# Altium schematic sheet power_connector.SchDoc
size A4
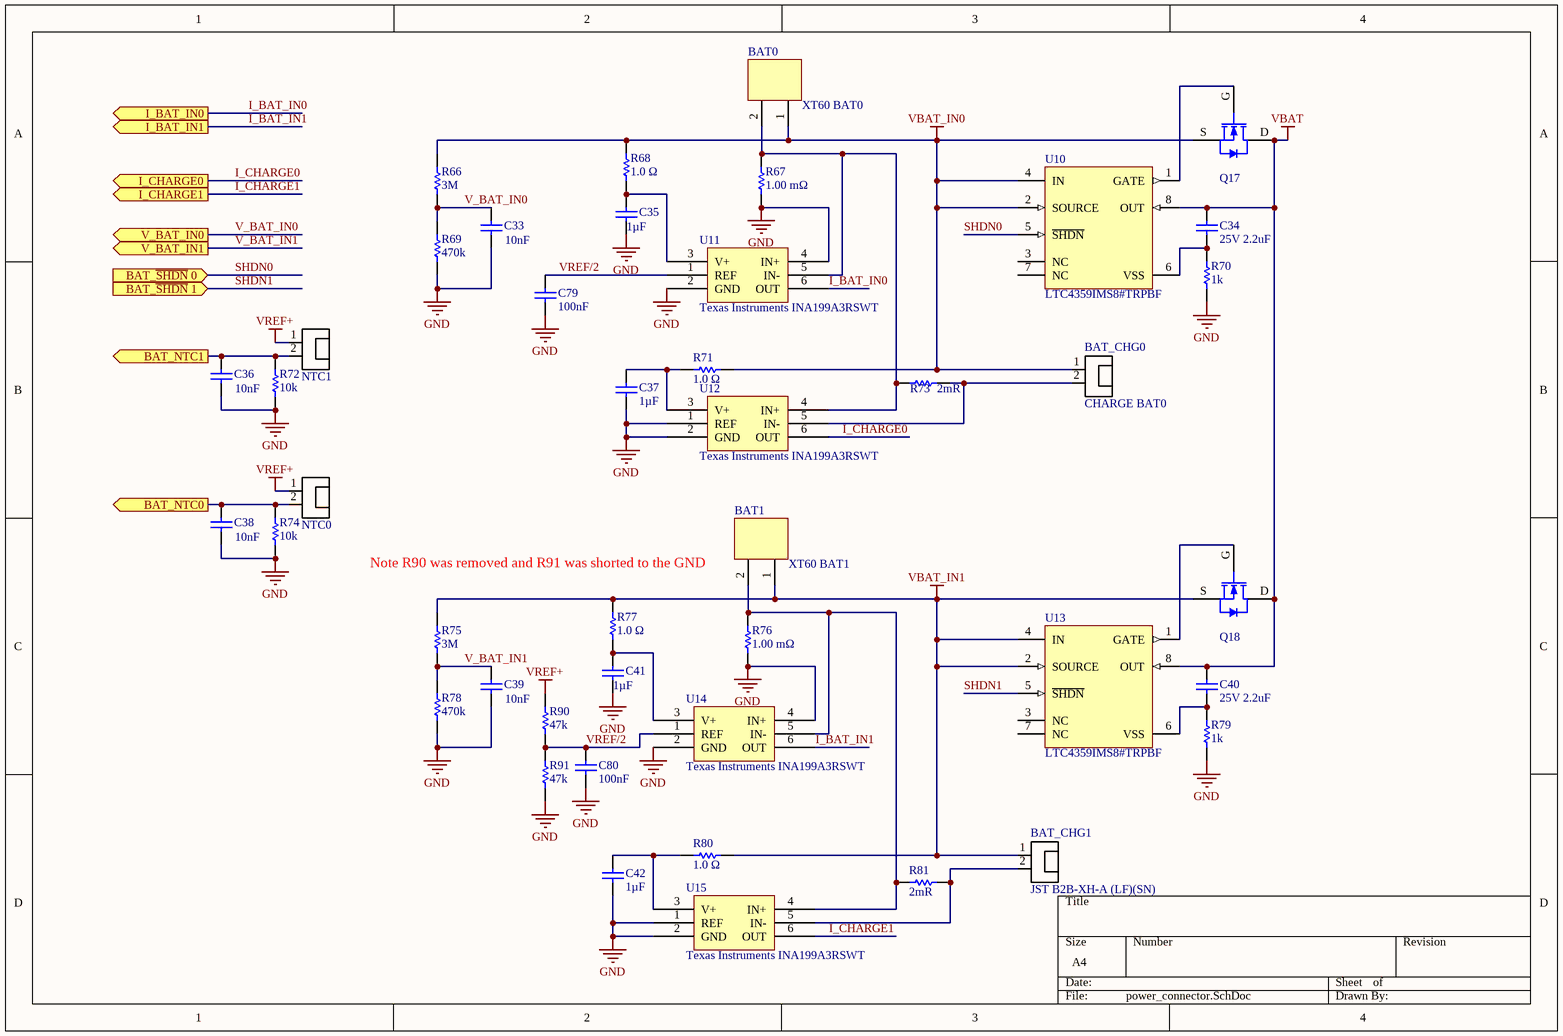
[diagram p0: power_connector.SchDoc]

## Parts
BAT0  XT60 BAT0  [PCB-8tmbcd94dx0l5ponnqur-1]
BAT1  XT60 BAT1  [PCB-8tmbcd94dx0l5ponnqur-1]
BAT_CHG0  CHARGE BAT0  [PCB-s8s8ac3ylnu6waak0fxh-1]
BAT_CHG1  JST B2B-XH-A (LF)(SN)  [PCB-s8s8ac3ylnu6waak0fxh-1]
C33  10nF  [RESC1005X40X25LL05T05]
C34  25V 2.2uF  [C0805]
C35  1µF  [CAPC1608X90X35LL15T15]
C36  10nF  [RESC1005X40X25LL05T05]
C37  1µF  [CAPC1608X90X35LL15T15]
C38  10nF  [RESC1005X40X25LL05T05]
C39  10nF  [RESC1005X40X25LL05T05]
C40  25V 2.2uF  [C0805]
C41  1µF  [CAPC1608X90X35LL15T15]
C42  1µF  [CAPC1608X90X35LL15T15]
C79  100nF  [CAPC1005X56X25NL10T15]
C80  100nF  [CAPC1005X56X25NL10T15]
NTC0  JST B2B-XH-A (LF)(SN)  [PCB-s8s8ac3ylnu6waak0fxh-1]  (value not drawn)
NTC1  JST B2B-XH-A (LF)(SN)  [PCB-s8s8ac3ylnu6waak0fxh-1]  (value not drawn)
Q17  SYM-77c1bbb3bdeca806-1  [PCB-0cgmvcmmtwpbvwdhxnni-1]  (value not drawn)
Q18  SYM-77c1bbb3bdeca806-1  [PCB-0cgmvcmmtwpbvwdhxnni-1]  (value not drawn)
R66  3M  [RESC1608X55X30LL15T15]
R67  1.00 mΩ  [PCB-wws5gc0zzodyoofoa1sn-1]
R68  1.0 Ω  [RESC1609X50X30LL10T20]
R69  470k  [RESC1609X55X30LL10T20]
R70  1k  [RESC1608X55X30NL15T15]
R71  1.0 Ω  [RESC1609X50X30LL10T20]
R72  10k  [RESC1608X55X30NL15T15]
R73  2mR  [RESC3216X89X51ML25T25]
R74  10k  [RESC1608X55X30NL15T15]
R75  3M  [RESC1608X55X30LL15T15]
R76  1.00 mΩ  [PCB-wws5gc0zzodyoofoa1sn-1]
R77  1.0 Ω  [RESC1609X50X30LL10T20]
R78  470k  [RESC1609X55X30LL10T20]
R79  1k  [RESC1608X55X30NL15T15]
R80  1.0 Ω  [RESC1609X50X30LL10T20]
R81  2mR  [RESC3216X89X51ML25T25]
R90  47k  [RESC1005X40X25LL05T10]
R91  47k  [RESC1005X40X25LL05T10]
U10  LTC4359IMS8#TRPBF  [LT-MS8-8_L]
U11  Texas Instruments INA199A3RSWT  [PCB-dzg43p1s5wcf61j10amz-1]
U12  Texas Instruments INA199A3RSWT  [PCB-dzg43p1s5wcf61j10amz-1]
U13  LTC4359IMS8#TRPBF  [LT-MS8-8_L]
U14  Texas Instruments INA199A3RSWT  [PCB-dzg43p1s5wcf61j10amz-1]
U15  Texas Instruments INA199A3RSWT  [PCB-dzg43p1s5wcf61j10amz-1]

## Ports
BAT_NTC0 (out), BAT_NTC1 (out), BAT_~{SHDN} 0 (in), BAT_~{SHDN} 1 (in), I_BAT_IN0 (out), I_BAT_IN1 (out), I_CHARGE0 (out), I_CHARGE1 (out), V_BAT_IN0 (out), V_BAT_IN1 (out)

## Nets
GND: C33.1 C35.2 C36.1 C37.2 C38.1 C39.1 C41.2 C42.2 C79.2 C80.2 R67.1 R69.1 R70.1 R72.1 R74.2 R76.1 R78.1 R79.1 R91.1 U11.2(GND) U11.4(IN+) U12.1(REF) U12.2(GND) U14.2(GND) U14.4(IN+) U15.1(REF) U15.2(GND)
VBAT: C34.1 C40.1 Q17.D Q18.D U10.8(OUT) U13.8(OUT)
VBAT_IN0: BAT0.1 BAT_CHG0.1 Q17.S R66.2 R68.2 R71.2 U10.2(SOURCE) U10.4(IN)
VBAT_IN1: BAT1.1 BAT_CHG1.1 Q18.S R75.2 R77.2 R80.2 U13.2(SOURCE) U13.4(IN)
VREF+: NTC0.1 NTC1.1 R90.2
BAT_NTC0: C38.2 NTC0.2 R74.1 ; port BAT_NTC0
BAT_NTC1: C36.2 NTC1.2 R72.2 ; port BAT_NTC1
I_BAT_IN0: U11.6(OUT) ; port I_BAT_IN0
I_BAT_IN1: U14.6(OUT) ; port I_BAT_IN1
I_CHARGE0: U12.6(OUT) ; port I_CHARGE0
I_CHARGE1: U15.6(OUT) ; port I_CHARGE1
SHDN0: U10.5(~{SHDN}) ; port BAT_~{SHDN} 0
SHDN1: U13.5(~{SHDN}) ; port BAT_~{SHDN} 1
V_BAT_IN0: C33.2 R66.1 R69.2 ; port V_BAT_IN0
V_BAT_IN1: C39.2 R75.1 R78.2 ; port V_BAT_IN1
VREF/2: C79.1 C80.1 R90.1 R91.2 U11.1(REF) U14.1(REF)
NetBAT0_2: BAT0.2 R67.2 R73.2 U11.5(IN-) U12.4(IN+)
NetBAT1_2: BAT1.2 R76.2 R81.1 U14.5(IN-) U15.4(IN+)
NetBAT_CHG0_2: BAT_CHG0.2 R73.1 U12.5(IN-)
NetBAT_CHG1_2: BAT_CHG1.2 R81.2 U15.5(IN-)
NetC34_2: C34.2 R70.2 U10.6(VSS)
NetC35_1: C35.1 R68.1 U11.3(V+)
NetC37_1: C37.1 R71.1 U12.3(V+)
NetC40_2: C40.2 R79.2 U13.6(VSS)
NetC41_1: C41.1 R77.1 U14.3(V+)
NetC42_1: C42.1 R80.1 U15.3(V+)
NetQ17_G: Q17.G U10.1(GATE)
NetQ18_G: Q18.G U13.1(GATE)

Not connected (* = marked no-connect by the designer): U10 3(NC) 7(NC); U13 3(NC) 7(NC)

## Notes on the sheet
- (near BAT1) Note R90 was removed and R91 was shorted to the GND

## Library data of the parts
BAT0 BAT1 = CMP-d8151592827e07d2-9: XT60 Connector Male
BAT_CHG0 = CMP-a2a66bdac84f7d61-16: XH Series 2 Position 2.5 mm Pitch Through Hole Top Entry Shrouded Header; Manufacturer Part Number: B2B-XH-A (LF)(SN); Gender: Male; Voltage Rating (AC): 250 V; Lead-Free Status: Lead Free; Insulation Resistance: 1.00 GΩ; Number of Contacts: 2; Contact Resistance: 10.0 mΩ; Current Rating: 3.00 A; Mounting Style: Through Hole, Vertical; RoHS: Compliant; Octopart URL: http://octopart.com/b2b-xh-a+%28lf%29%28sn%29-jst-7753615; Contact Material: Brass; REACH SVHC Compliance: No SVHC; OctopartID: a2a66bdac84f7d61; Contact Plating: Tin
BAT_CHG1 NTC0 NTC1 = CMP-a2a66bdac84f7d61-16: XH Series 2 Position 2.5 mm Pitch Through Hole Top Entry Shrouded Header; Gender: Male; Voltage Rating (AC): 250 V; Lead-Free Status: Lead Free; Insulation Resistance: 1.00 GΩ; Number of Contacts: 2; Contact Resistance: 10.0 mΩ; Current Rating: 3.00 A; Mounting Style: Through Hole, Vertical; RoHS: Compliant; Manufacturer Part Number: B2B-XH-A (LF)(SN); Octopart URL: http://octopart.com/b2b-xh-a+%28lf%29%28sn%29-jst-7753615; Contact Material: Brass; REACH SVHC Compliance: No SVHC; OctopartID: a2a66bdac84f7d61; Contact Plating: Tin
C33 C36 C38 C39 = CMP-16527022-3: 0.01uF Capacitor; Manufacturer Part Number: 04025C103KAT2A; Capacitance Tolerance: ±10%; Voltage Rating (DC): 50.0 V; Dielectric Characteristic: X7R; Lead-Free Status: Lead Free; Capacitance: 1e-08 F; Octopart Url: https://octopart.com/04025c103kat2a-avx+interconnect+%2F+elco-20614010; OctopartID: 72f7bac7dcebad30; REACH SVHC Compliance: No SVHC; Packaging: Cut Tape (CT); RoHS: Compliant; Case/Package: 0402
C34 C40 = CMP-84b64f3479215b71-1: 0805 2.2 uF 25 V ±10 % Tolerance X7R SMT Multilayer Ceramic Capacitor; Manufacturer Part Number: CC0805KKX7R8BB225; Lead-Free Status: Lead Free; Capacitance Tolerance: ±10%; Voltage Rating (DC): 25.0 V; Capacitance: 2.2e-06 F; Halogen Free Status: Halogen Free; Seller Landing  Url: https://octopart-clicks.com/click/track?country=US&ak=8157f166&sig=0c113c1&sid=2402&ppid=42522865&vpid=20053140&ct=offers; Packaging: Cut Tape (CT); Mounting Style: Surface Mount; Case/Package: 0805; REACH SVHC Compliance: No SVHC; Number of Pins: 2; OctopartID: 84b64f3479215b71; Dielectric Characteristic: X7R; RoHS: Compliant; Octopart Url: http://octopart.com/cc0805kkx7r8bb225-yageo-42522865
C35 C37 C41 C42 = CMP-f2f83b8d074c2d3f-6: 0603 1 uF 16 V ±10 % Tolerance X5R SMT Multilayer Ceramic Capacitor; Capacitance Tolerance: ±10%; Lead-Free Status: Lead Free; Voltage Rating (DC): 16.0 V; Dielectric Characteristic: X5R; Mounting Style: Surface Mount; OctopartID: f2f83b8d074c2d3f
C79 C80 = CMP-bf2276a55d9a60e5-19: Ceramic capacitor SMD-0402 100nF /16V X7R# K +-10%, Samsung, RoHS; Dielectric Characteristic: X7R; Lead-Free Status: Lead Free; Mounting Style: Surface Mount; Capacitance: 100 nF; Case/Package: 0402; OctopartID: 0755ced2c795d892
Q17 Q18 = CMP-77c1bbb3bdeca806-1: Trans MOSFET N-CH 60V 42.8A 8-Pin PowerPAK SO-DC EP T/R; Manufacturer Part Number: SIDR626DP-T1-GE3; Operating Temperature: 150 °C (max); OctopartID: 77c1bbb3bdeca806
R66 R75 = CMP-3654610-2: Thick Film Resistors - SMD 0603 3Mohms 5% Tol; Manufacturer Part Number: ERJ-3GEYJ305V; Power Rating: 0.1 W; Resistance: 3000000.0 Ω; Voltage Rating (DC): 75.0 V; Case/Package: 0603; Lifecycle Status: Not Listed by Manufacturer; Mounting Style: Surface Mount; Octopart Url: https://octopart.com/erj-3geyj305v-panasonic-39833078; OctopartID: 96625d377ef249a5; Packaging: Cut Tape (CT); REACH SVHC Compliance: No SVHC; Resistance Tolerance: ±5%; RoHS: Compliant; Size-Height: 0.00045 m; Size-Length: 0.0016 m; Size-Width: 0.0008 m
R67 R76 = CMP-5c9b974035f1835c-1: Res Thick Film 2512 0.001 Ohm 1% 3W ±50ppm/C Pad SMD Automotive T/R; Manufacturer Part Number: CRE2512-FZ-R001E-3; Power Rating: 3.00 W; Temperature Coefficient: -75.0 ppm/°C to 75.0 ppm/°C; Mounting Style: Solder; RoHS: Compliant; Packaging: Tape & Reel (TR), Cut Tape (CT); Resistance: 1.00 mΩ; Resistance Tolerance: ±1%; OctopartID: 5c9b974035f1835c; Octopart URL: https://octopart.com/cre2512-fz-r001e-3-bourns-47270924; REACH SVHC Compliance: No SVHC
R68 R71 R77 R80 = CMP-1856057-2: RES SMD 1 OHM 5% 1/10W 0603; Manufacturer Part Number: CRCW06031R00JNEA; Lead-Free Status: Lead Free; Power Rating: 0.1 W; Temperature Coefficient: 200.0 ppm/°C; Voltage Rating (DC): 75.0 V; Case/Package: 0603; Mounting Style: Surface Mount; Number of Pins: 2; Octopart Url: https://octopart.com/crcw06031r00jnea-vishay-39838014; OctopartID: a4176f42604f7bd0; Packaging: Cut Tape (CT); Resistance: 1.0 Ω; Resistance Tolerance: ±5%; RoHS: Compliant; Size-Height: 0.00045 m; Size-Length: 0.00155 m; Size-Width: 0.00085 m
R69 R78 = CMP-d1221a8dcd300ee5-2: Res Thick Film 0603 1M Ohm 1% 0.33W(1/3W) ±100ppm/°C Pad SMD Automotive T/R; Manufacturer Part Number: CRCW06031M00FKEAHP; Lead-Free Status: Lead Free; Voltage Rating (DC): 75.0 V; Resistance: 1.00 MΩ; Power Rating: 250 mW; Min Operating Temperature: -55 °C; RoHS: Compliant; OctopartID: 44b98f1658ac9b7e; Mounting Style: Surface Mount; Octopart URL: https://octopart.com/crcw06031m00fkeahp-vishay-44382579; Packaging: Reel; Max Operating Temperature: 155 °C; Case/Package: 0603
R70 R79 = CMP-68a0a2e72c4eb767-21: Res Thick Film 0603 1K Ohm 5% 1/10W ±100ppm/°C Molded SMD SMD Paper T/R
R72 R74 = CMP-a8e96364fc37772e-4: Res Thin Film 0603 10K Ohm 1% 1/16W ±50ppm/°C Molded SMD SMD Paper T/R; ELV Compliant: Compliant; Power Rating: 63.0 mW; Case/Package (SI): 1608; Packaging: Tape & Reel (TR)
R73 R81 = CMP-1863047-2: Res Metal Strip 1206 0.02 Ohm 1% 0.25W(1/4W) ±75ppm/C Molded SMD Automotive Embossed Plastic T/R; Manufacturer Part Number: WSL1206R0200FEA; Case/Package (SI): 3216; Lead-Free Status: Lead Free; Resistance: 0.02 Ω; Mounting Style: Surface Mount; Number of Pins: 2; Octopart Url: https://octopart.com/wsl1206r0200fea-vishay-39744192; OctopartID: 364ffd1b61e9e988; Power Rating: 0.25 W; REACH SVHC Compliance: No SVHC; Resistance Tolerance: ±1%; RoHS: Compliant; Size-Height: 0.000635 m; Size-Length: 0.0032004 m; Size-Width: 0.0016002 m
R90 R91 = CMP-1859043-2: Thick Film Resistors - SMD 1/8watt 47Kohms 1% 100ppm High Power; Manufacturer Part Number: CRCW040247K0FKEDHP; Lead-Free Status: Lead Free; Power Rating: 0.063 W; Resistance: 47000.0 Ω; Case/Package: 0402; Octopart Url: https://octopart.com/crcw040247k0fkedhp-vishay+dale-44383189; OctopartID: 3aaef101241de569; Resistance Tolerance: ±1%; RoHS: Compliant
U10 U13 = CMP-3088331-2: Ideal Diode Controller with Reverse Input Protection, 4 to 80 V Vin, 8-pin SOP (MS8-8), -40 to 85 degC, Pb-Free, Tape and Reel; Manufacturer Part Number: LTC4359IMS8#TRPBF; Octopart Url: https://octopart.com/ltc4359ims8%23trpbf-linear+technology-22629374; OctopartID: a3b26be1cd2a7c75; RoHS: Compliant
U11 U12 U14 U15 = CMP-0f05c77d0cddd0c2-11: 26-V, Bi-Directional, Zero-Drift, Low- or High-Side, Voltage Output Current Shunt Monitor 6-SC70 -40 to 125; Lead-Free Status: Lead Free; Mounting Style: Surface Mount; RoHS: Compliant; Octopart URL: http://octopart.com/ina199b3dckr-texas+instruments-24258238; OctopartID: 0f05c77d0cddd0c2